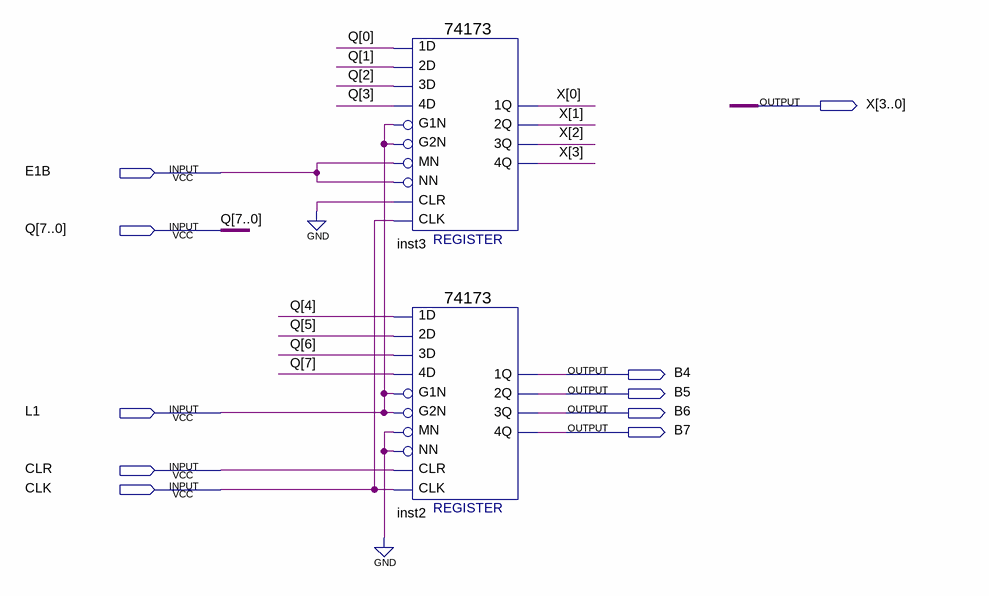
[diagram p0: schematic sheet]
// Quartus schematic Registrador_Instrucoes.bdf as structural Verilog: 2 symbols, 10 pins
module Registrador_Instrucoes (
  input  E1B,
  input  [7:0] Q,
  input  L1,
  input  CLR,
  input  CLK,
  output [3:0] X,
  output B4,
  output B5,
  output B6,
  output B7
);

  \74173  inst3 (
    .\3D (Q[2]), .MN(E1B), .\1D (Q[0]), .\2D (Q[1]), .\4D (Q[3]), .G1N(L1), .G2N(L1), .NN(E1B), .CLR(1'b0),
    .CLK(CLK), .\3Q (X[2]), .\2Q (X[1]), .\1Q (X[0]), .\4Q (X[3]));
  \74173  inst2 (
    .\3D (Q[6]), .MN(1'b0), .\1D (Q[4]), .\2D (Q[5]), .\4D (Q[7]), .G1N(L1), .G2N(L1), .NN(1'b0), .CLR(CLR),
    .CLK(CLK), .\3Q (B6), .\2Q (B5), .\1Q (B4), .\4Q (B7));
endmodule
